# EAGLE design canprotoshield_eth (EAGLE 7.2.0)
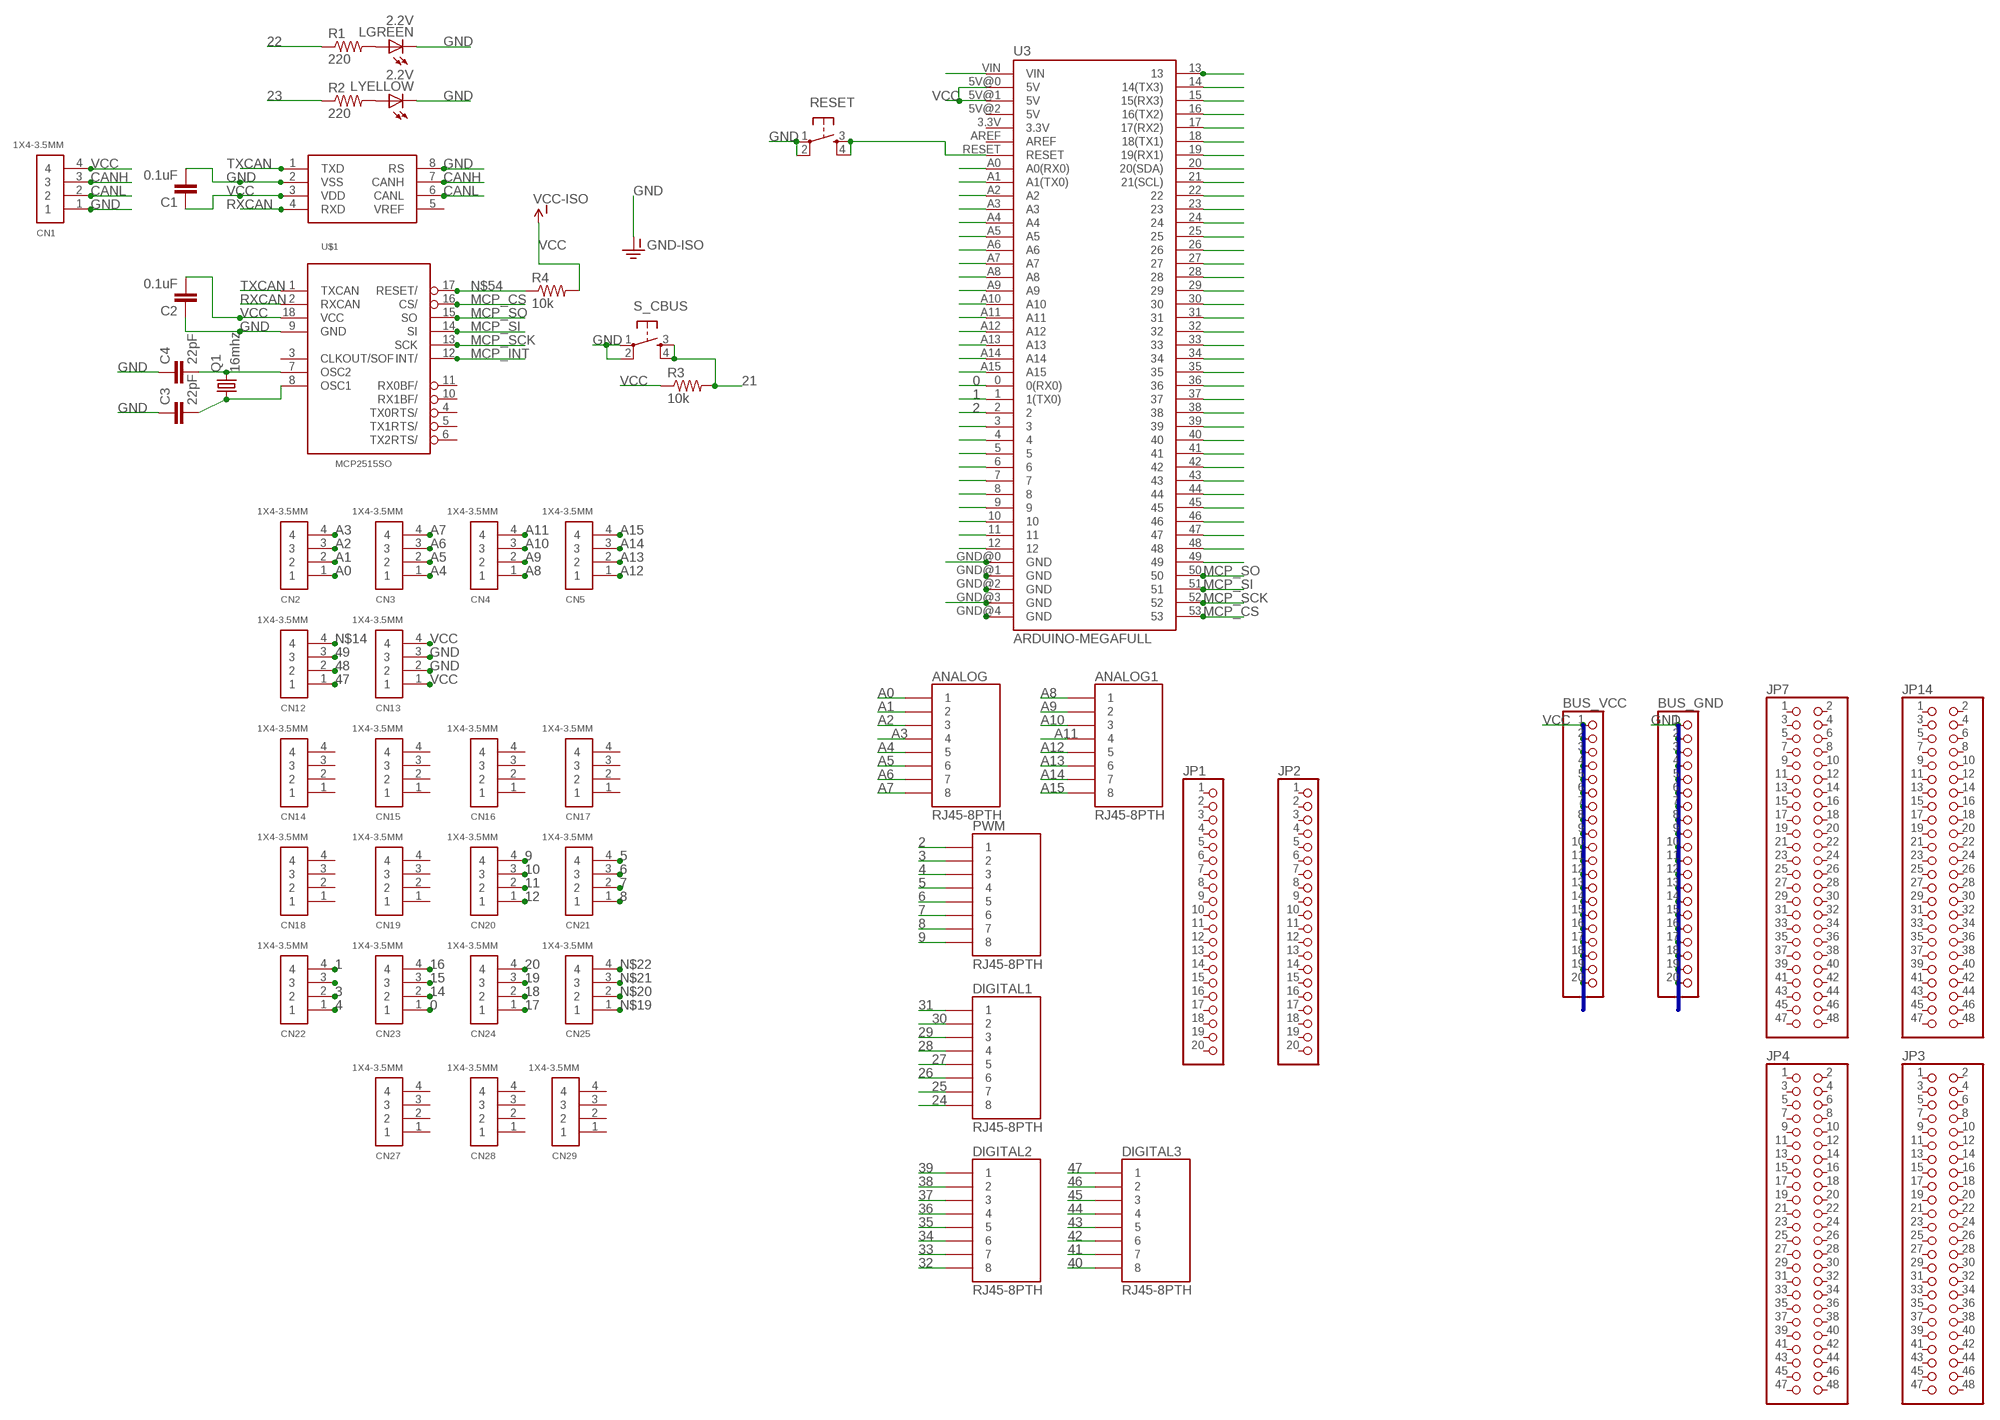
[diagram p0: schematic, sheet 1]

## Parts
ANALOG  RJ45-8PTH  [RJ45-8]
ANALOG1  RJ45-8PTH  [RJ45-8]
BUS_GND  PINHD-1X20  [1X20]
BUS_VCC  PINHD-1X20  [1X20]
C1  0.1uF  CAP0805  [0805]
C2  0.1uF  CAP0805  [0805]
C3  22pF  CAP0805  [0805]
C4  22pF  CAP0805  [0805]
CN1  1X4-3.5MM  [1X04-3.5MM]
CN2  1X4-3.5MM  [1X04-3.5MM]
CN3  1X4-3.5MM  [1X04-3.5MM]
CN4  1X4-3.5MM  [1X04-3.5MM]
CN5  1X4-3.5MM  [1X04-3.5MM]
CN12  1X4-3.5MM  [1X04-3.5MM]
CN13  1X4-3.5MM  [1X04-3.5MM]
CN14  1X4-3.5MM  [1X04-3.5MM]
CN15  1X4-3.5MM  [1X04-3.5MM]
CN16  1X4-3.5MM  [1X04-3.5MM]
CN17  1X4-3.5MM  [1X04-3.5MM]
CN18  1X4-3.5MM  [1X04-3.5MM]
CN19  1X4-3.5MM  [1X04-3.5MM]
CN20  1X4-3.5MM  [1X04-3.5MM]
CN21  1X4-3.5MM  [1X04-3.5MM]
CN22  1X4-3.5MM  [1X04-3.5MM]
CN23  1X4-3.5MM  [1X04-3.5MM]
CN24  1X4-3.5MM  [1X04-3.5MM]
CN25  1X4-3.5MM  [1X04-3.5MM]
CN27  1X4-3.5MM  [1X04-3.5MM]
CN28  1X4-3.5MM  [1X04-3.5MM]
CN29  1X4-3.5MM  [1X04-3.5MM]
DIGITAL1  RJ45-8PTH  [RJ45-8]
DIGITAL2  RJ45-8PTH  [RJ45-8]
DIGITAL3  RJ45-8PTH  [RJ45-8]
JP1  PINHD-1X20-BIG  [1X20-BIG]
JP2  PINHD-1X20-BIG  [1X20-BIG]
JP3  PINHD-2X24  [2X24]
JP4  PINHD-2X24  [2X24]
JP7  PINHD-2X24  [2X24]
JP14  PINHD-2X24  [2X24]
LGREEN  2.2V  LED3MM  [LED3MM]
LYELLOW  2.2V  LED3MM  [LED3MM]
PWM  RJ45-8PTH  [RJ45-8]
Q1  16mhz  CRYSTALHC49S  [HC49/S]
R1  220  R-US_M2012  [M2012]
R2  220  R-US_M2012  [M2012]
R3  10k  R-US_M2012  [M2012]
R4  10k  R-US_M2012  [M2012]
RESET  TAC_SWITCHPTH  [TACTILE-PTH]
S_CBUS  TAC_SWITCHPTH  [TACTILE-PTH]
U2  MCP2551  [SO08]
U3  ARDUINO-MEGAFULL  [ARDUINO_MEGA]
U$1  MCP2515SO  [SO18L]

## Nets
0: CN23.1 U3.0(0(RX0))
1: CN22.4 U3.1(1(TX0))
2: CN22.3 PWM.1 U3.2
3: CN22.2 PWM.2 U3.3
4: CN22.1 PWM.3 U3.4
5: CN21.4 PWM.4 U3.5
6: CN21.3 PWM.5 U3.6
7: CN21.2 PWM.6 U3.7
8: CN21.1 PWM.7 U3.8
9: CN20.4 PWM.8 U3.9
10: CN20.3 U3.10
11: CN20.2 U3.11
12: CN20.1 U3.12
13: U3.13
14: CN23.2 U3.14(14(TX3))
15: CN23.3 U3.15(15(RX3))
16: CN23.4 U3.16(16(TX2))
17: CN24.1 U3.17(17(RX2))
18: CN24.2 U3.18(18(TX1))
19: CN24.3 U3.19(19(RX1))
20: CN24.4 U3.20(20(SDA))
21: R3.2 S_CBUS.3 S_CBUS.4 U3.21(21(SCL))
22: R1.1 U3.22
23: R2.1 U3.23
24: DIGITAL1.8 U3.24
25: DIGITAL1.7 U3.25
26: DIGITAL1.6 U3.26
27: DIGITAL1.5 U3.27
28: DIGITAL1.4 U3.28
29: DIGITAL1.3 U3.29
30: DIGITAL1.2 U3.30
31: DIGITAL1.1 U3.31
32: DIGITAL2.8 U3.32
33: DIGITAL2.7 U3.33
34: DIGITAL2.6 U3.34
35: DIGITAL2.5 U3.35
36: DIGITAL2.4 U3.36
37: DIGITAL2.3 U3.37
38: DIGITAL2.2 U3.38
39: DIGITAL2.1 U3.39
40: DIGITAL3.8 U3.40
41: DIGITAL3.7 U3.41
42: DIGITAL3.6 U3.42
43: DIGITAL3.5 U3.43
44: DIGITAL3.4 U3.44
45: DIGITAL3.3 U3.45
46: DIGITAL3.2 U3.46
47: CN12.1 DIGITAL3.1 U3.47
48: CN12.2 U3.48
49: CN12.3 U3.49
A0: ANALOG.1 CN2.1 U3.A0(A0(RX0))
A1: ANALOG.2 CN2.2 U3.A1(A1(TX0))
A2: ANALOG.3 CN2.3 U3.A2
A3: ANALOG.4 CN2.4 U3.A3
A4: ANALOG.5 CN3.1 U3.A4
A5: ANALOG.6 CN3.2 U3.A5
A6: ANALOG.7 CN3.3 U3.A6
A7: ANALOG.8 CN3.4 U3.A7
A8: ANALOG1.1 CN4.1 U3.A8
A9: ANALOG1.2 CN4.2 U3.A9
A10: ANALOG1.3 CN4.3 U3.A10
A11: ANALOG1.4 CN4.4 U3.A11
A12: ANALOG1.5 CN5.1 U3.A12
A13: ANALOG1.6 CN5.2 U3.A13
A14: ANALOG1.7 CN5.3 U3.A14
A15: ANALOG1.8 CN5.4 U3.A15
CANH: CN1.3 U2.7(CANH)
CANL: CN1.2 U2.6(CANL)
GND: BUS_GND.1 C1.2 C2.1 C3.1 C4.1 CN1.1 CN13.2 CN13.3 LGREEN.K(C) LYELLOW.K(C) RESET.1 RESET.2 S_CBUS.1 S_CBUS.2 U2.8(RS) U3.GND@0(GND) U3.GND@3(GND) U3.GND@4(GND) U$1.9(GND) ; supply symbol labelled GND-ISO
MCP_CS: U3.53 U$1.16(CS/)
MCP_INT: U$1.12(INT/)
MCP_SCK: U3.52 U$1.13(SCK)
MCP_SI: U3.51 U$1.14(SI)
MCP_SO: U3.50 U$1.15(SO)
N$1: C4.2 Q1.2 U$1.7(OSC2)
N$2: C3.2 Q1.1 U$1.8(OSC1)
N$3: LYELLOW.A R2.2
N$4: LGREEN.A R1.2
N$5: BUS_VCC.1
N$6: BUS_VCC.2
N$7: BUS_VCC.3
N$8: BUS_VCC.4
N$9: RESET.3 RESET.4 U3.RESET
N$10: BUS_VCC.5
N$11: BUS_VCC.6
N$12: BUS_VCC.7
N$13: BUS_VCC.8
N$14: CN12.4
N$15: BUS_VCC.9
N$16: BUS_VCC.10
N$17: BUS_VCC.11
N$18: BUS_VCC.12
N$19: CN25.1
N$20: CN25.2
N$21: CN25.3
N$22: CN25.4
N$23: BUS_VCC.13
N$24: BUS_VCC.14
N$25: BUS_VCC.15
N$26: BUS_VCC.16
N$27: BUS_VCC.17
N$28: BUS_VCC.18
N$29: BUS_VCC.19
N$30: BUS_VCC.20
N$32: BUS_GND.2
N$33: BUS_GND.3
N$34: BUS_GND.4
N$35: BUS_GND.5
N$36: BUS_GND.6
N$37: BUS_GND.7
N$38: BUS_GND.8
N$39: BUS_GND.9
N$40: BUS_GND.10
N$41: BUS_GND.11
N$42: BUS_GND.12
N$43: BUS_GND.13
N$44: BUS_GND.14
N$45: BUS_GND.15
N$46: BUS_GND.16
N$47: BUS_GND.17
N$48: BUS_GND.18
N$49: BUS_GND.19
N$50: BUS_GND.20
N$54: R4.1 U$1.17(RESET/)
N$55: U3.GND@1(GND)
N$56: U3.GND@2(GND)
RXCAN: U2.4(RXD) U$1.2(RXCAN)
TXCAN: U2.1(TXD) U$1.1(TXCAN)
VCC: C1.1 C2.2 CN1.4 CN13.1 CN13.4 R3.1 R4.2 U3.5V@0(5V) U3.5V@1(5V) U$1.18(VCC) ; supply symbol labelled VCC-ISO
VIN: U3.VIN
Unconnected: CN14.1 CN14.2 CN14.3 CN14.4 CN15.1 CN15.2 CN15.3 CN15.4 CN16.1 CN16.2 CN16.3 CN16.4 CN17.1 CN17.2 CN17.3 CN17.4 CN18.1 CN18.2 CN18.3 CN18.4 CN19.1 CN19.2 CN19.3 CN19.4 CN27.1 CN27.2 CN27.3 CN27.4 CN28.1 CN28.2 CN28.3 CN28.4 CN29.1 CN29.2 CN29.3 CN29.4 JP1.1 JP1.2 JP1.3 JP1.4 JP1.5 JP1.6 JP1.7 JP1.8 JP1.9 JP1.10 JP1.11 JP1.12 JP1.13 JP1.14 JP1.15 JP1.16 JP1.17 JP1.18 JP1.19 JP1.20 JP2.1 JP2.2 JP2.3 JP2.4 JP2.5 JP2.6 JP2.7 JP2.8 JP2.9 JP2.10 JP2.11 JP2.12 JP2.13 JP2.14 JP2.15 JP2.16 JP2.17 JP2.18 JP2.19 JP2.20 JP3.1 JP3.2 JP3.3 JP3.4 JP3.5 JP3.6 JP3.7 JP3.8 JP3.9 JP3.10 JP3.11 JP3.12 JP3.13 JP3.14 JP3.15 JP3.16 JP3.17 JP3.18 JP3.19 JP3.20 JP3.21 JP3.22 JP3.23 JP3.24 JP3.25 JP3.26 JP3.27 JP3.28 JP3.29 JP3.30 JP3.31 JP3.32 JP3.33 JP3.34 JP3.35 JP3.36 JP3.37 JP3.38 JP3.39 JP3.40 JP3.41 JP3.42 JP3.43 JP3.44 JP3.45 JP3.46 JP3.47 JP3.48 JP4.1 JP4.2 JP4.3 JP4.4 JP4.5 JP4.6 JP4.7 JP4.8 JP4.9 JP4.10 JP4.11 JP4.12 JP4.13 JP4.14 JP4.15 JP4.16 JP4.17 JP4.18 JP4.19 JP4.20 JP4.21 JP4.22 JP4.23 JP4.24 JP4.25 JP4.26 JP4.27 JP4.28 JP4.29 JP4.30 JP4.31 JP4.32 JP4.33 JP4.34 JP4.35 JP4.36 JP4.37 JP4.38 JP4.39 JP4.40 JP4.41 JP4.42 JP4.43 JP4.44 JP4.45 JP4.46 JP4.47 JP4.48 JP7.1 JP7.2 JP7.3 JP7.4 JP7.5 JP7.6 JP7.7 JP7.8 JP7.9 JP7.10 JP7.11 JP7.12 JP7.13 JP7.14 JP7.15 JP7.16 JP7.17 JP7.18 JP7.19 JP7.20 JP7.21 JP7.22 JP7.23 JP7.24 JP7.25 JP7.26 JP7.27 JP7.28 JP7.29 JP7.30 JP7.31 JP7.32 JP7.33 JP7.34 JP7.35 JP7.36 JP7.37 JP7.38 JP7.39 JP7.40 JP7.41 JP7.42 JP7.43 JP7.44 JP7.45 JP7.46 JP7.47 JP7.48 JP14.1 JP14.2 JP14.3 JP14.4 JP14.5 JP14.6 JP14.7 JP14.8 JP14.9 JP14.10 JP14.11 JP14.12 JP14.13 JP14.14 JP14.15 JP14.16 JP14.17 JP14.18 JP14.19 JP14.20 JP14.21 JP14.22 JP14.23 JP14.24 JP14.25 JP14.26 JP14.27 JP14.28 JP14.29 JP14.30 JP14.31 JP14.32 JP14.33 JP14.34 JP14.35 JP14.36 JP14.37 JP14.38 JP14.39 JP14.40 JP14.41 JP14.42 JP14.43 JP14.44 JP14.45 JP14.46 JP14.47 JP14.48 U2.2(VSS) U2.3(VDD) U2.5(VREF) U3.3.3V U3.5V@2(5V) U3.AREF U$1.3(CLKOUT/SOF) U$1.4(TX0RTS/) U$1.5(TX1RTS/) U$1.6(TX2RTS/) U$1.10(RX1BF/) U$1.11(RX0BF/)

## Buses
GND
VCC

## Library data of the parts
ANALOG ANALOG1 DIGITAL1-DIGITAL3 PWM = SparkFun-Connectors:RJ45-8: RJ45 Jack Simple RJ45, 8-pin connection - connector for common Cat5, Cat5e, and Cat6 Ethernet cables. Footprint not yet proven in production. Connector sku is PRT-00643; Breakout PCB sku is BOB-00716.
BUS_GND BUS_VCC JP1 JP2 = adafruit:PINHD-1X20: PIN HEADER
C1-C4 = SparkFun-Capacitors:CAP: Capacitor Standard 0603 ceramic capacitor, and 0.1" leaded capacitor.
CN1-CN5 CN12-CN25 CN27-CN29 = Arduino_merg:1X4: 4-pin connector
JP3 JP4 JP7 JP14 = pinhead:PINHD-2X24: PIN HEADER
LGREEN LYELLOW = adafruit:LED: LED OSRAM: - CHIPLED LG R971, LG N971, LY N971, LG Q971, LY Q971, LO R971, LY R971 LH N974, LH R974 LS Q976, LO Q976, LY Q976 LO Q996 - Hyper CHIPLED LW Q18S LB Q993, LB Q99A, LB R99A - SideLED LS A670, LO A670, LY A670, LG A670, LP A670 LB A673, LV A673, LT A673, LW A673 LH A674 LY A675 LS A676, LA A676, LO A676, LY A676, LW A676 LS A679, LY A679, LG A679 - Hyper Micro SIDELED® LS Y876, LA Y876, LO Y876, LY Y876 LT Y87S - SmartLED LW L88C, LW L88S LB L89C, LB L89S, LG L890 LS L89K, LO L89K, LY L89K LS L896, LA L896, LO L896, LY L896 - TOPLED LS T670, LO T670, LY T670, LG T670, LP T670 LSG T670, LSP T670, LSY T670, LOP T670, LYG T670 LG T671, LOG T671, LSG T671 LB T673, LV T673, LT T673, LW T673 LH T674 LS T676, LA T676, LO T676, LY T676, LB T676, LH T676, LSB T676, LW T676 LB T67C, LV T67C, LT T67C, LS T67K, LO T67K, LY T67K, LW E67C LS E67B, LA E67B, LO E67B, LY E67B, LB E67C, LV E67C, LT E67C LW T67C LS T679, LY T679, LG T679 LS T770, LO T770, LY T770, LG T770, LP T770 LB T773, LV T773, LT T773, LW T773 LH T774 LS E675, LA E675, LY E675, LS T675 LS T776, LA T776, LO T776, LY T776, LB T776 LHGB T686 LT T68C, LB T68C - Hyper Mini TOPLED® LB M676 - Mini TOPLED Santana® LG M470 LS M47K, LO M47K, LY M47K Source: http://www.osram.convergy.de/
Q1 = adafruit:CRYSTAL: CRYSTAL; OC_FARNELL: 1667008; OC_NEWARK: unknown
R1-R4 = adafruit:R-US_: RESISTOR, American symbol
RESET S_CBUS = SparkFun-Retired:TAC_SWITCH: Momentary Switch Button commonly used for reset or general input. Spark Fun Electronics SKU : COM-00097 SMT- SWCH-08247
U2 = SparkFun-DigitalIC:MCP2551: CAN transceiver; PROD_ID: IC-09907
U3 = Arduino_merg:ARDUINO-MEGA: Arduino Mega board footprint
U$1 = MCP2515_MT:MCP2515*: MCP2515 Standalone CAN-Controller by Microchip Eagle-Lib. by MartinThomas

## Board
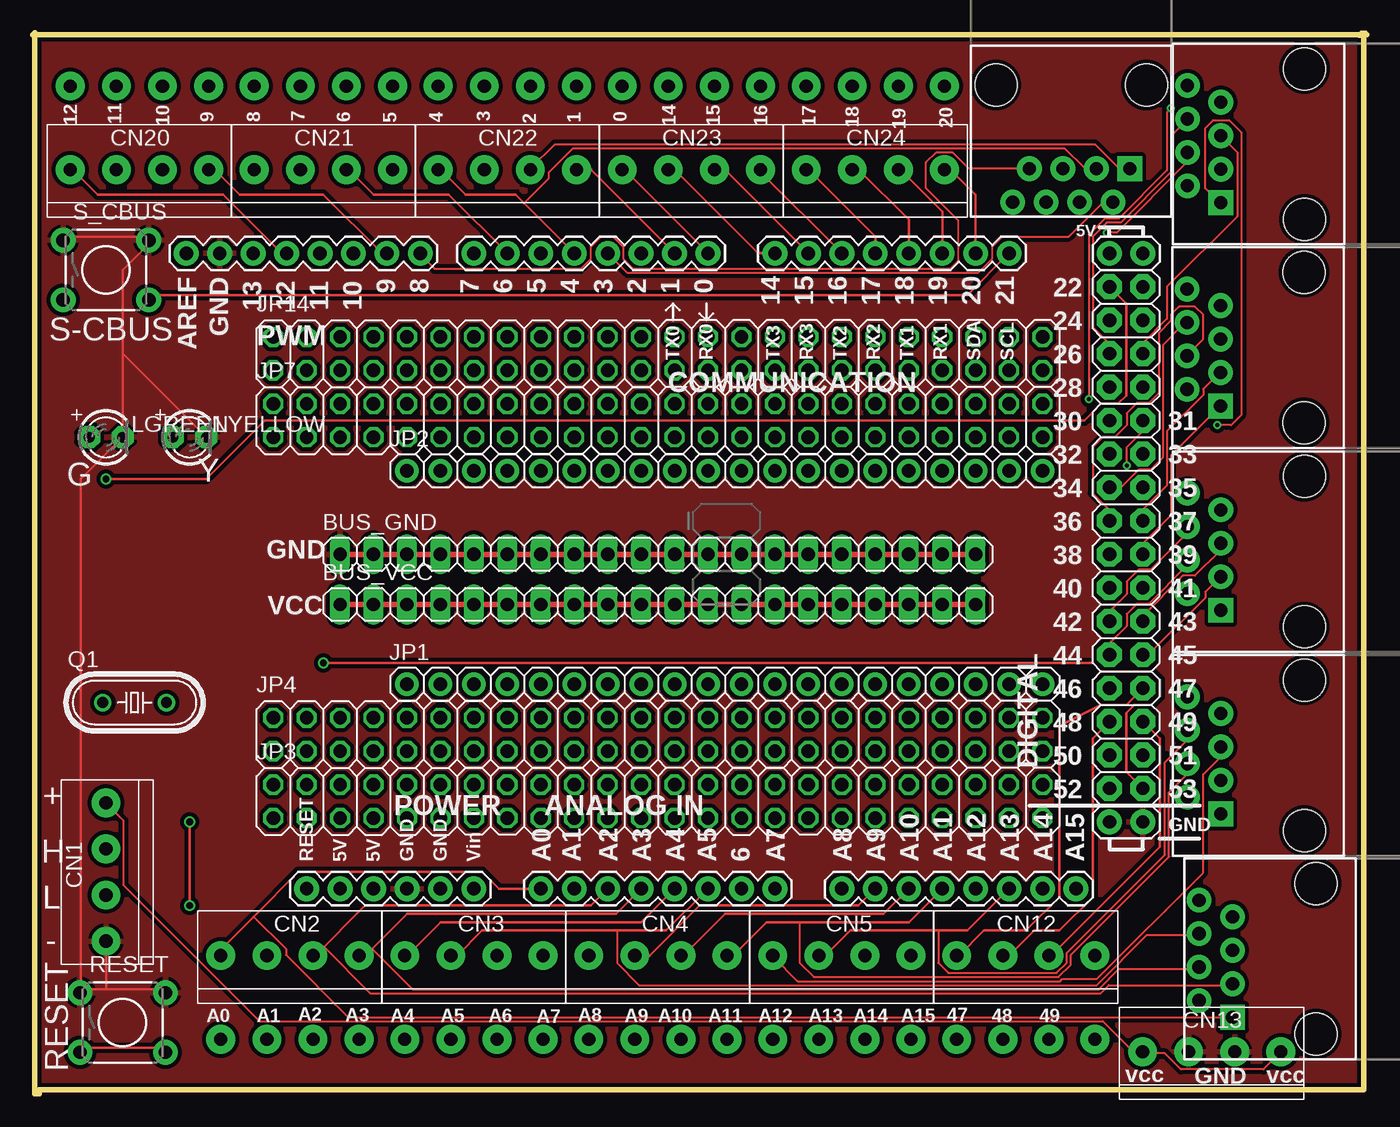
[diagram p1: board, top side]
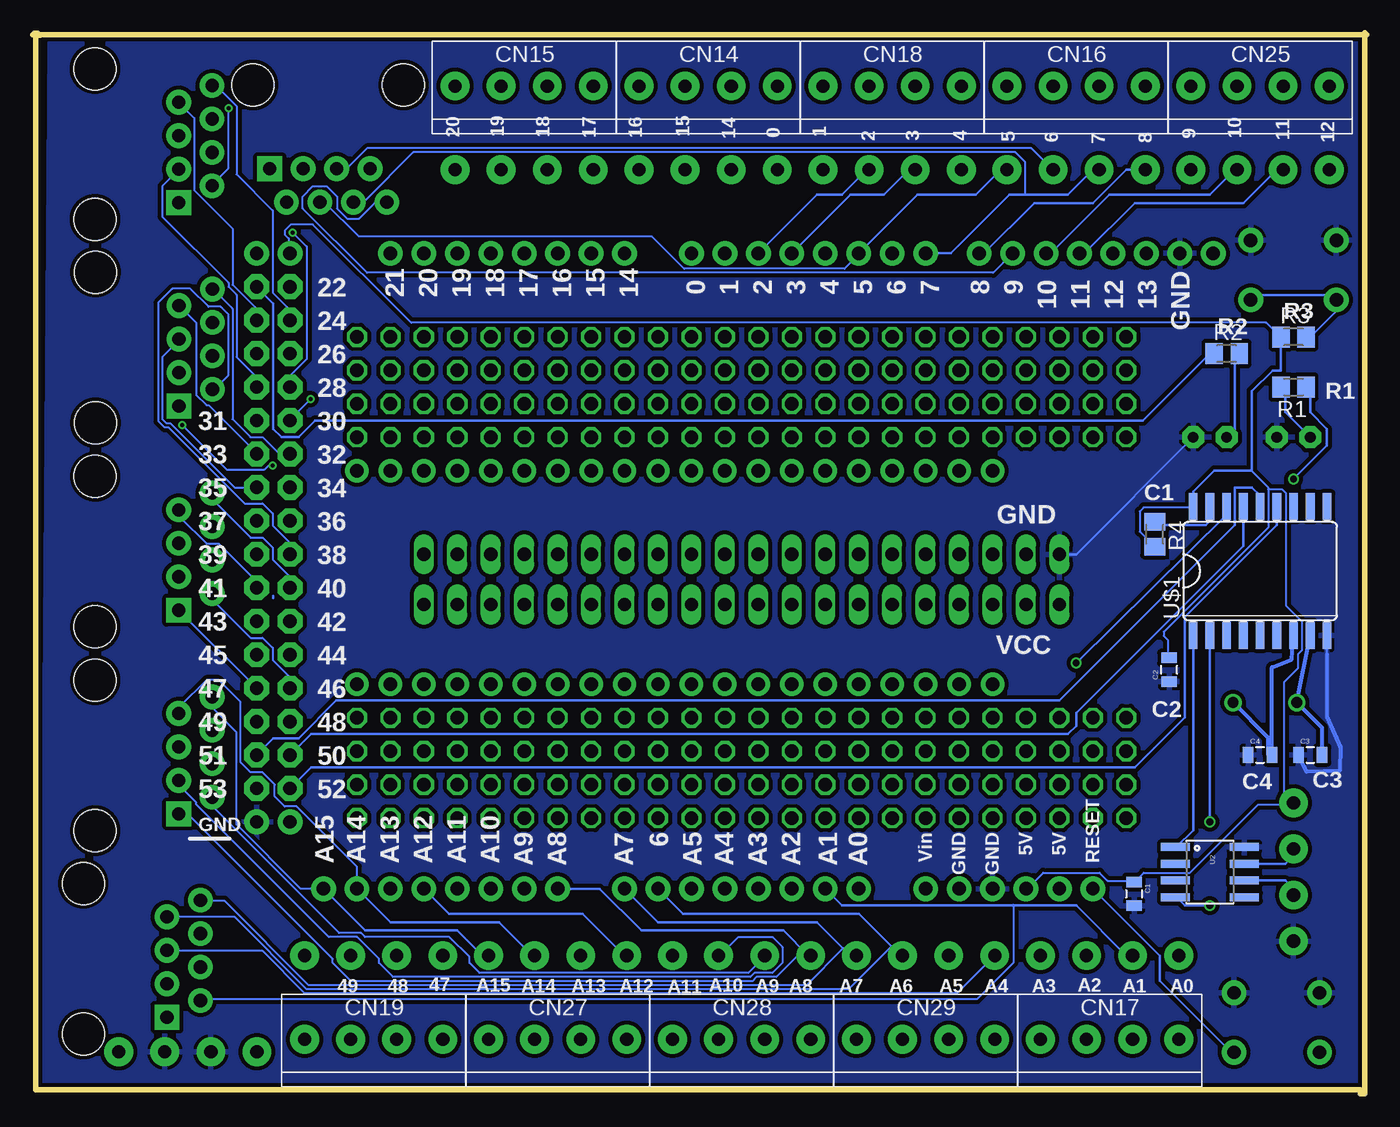
[diagram p2: board, bottom side, seen from below]

Size 101.27 x 80.57 mm. Coordinates in mm from the lower left corner, seen from the top.
Outline: 0.47,0.34 100.47,0.34
Outline: 100.47,80.34 0.47,80.34
Outline: 100.72,80.4 101.05,80.4 101.05,0.31 0.47,0.31 0.47,0 0.13,0 0.13,80.57
Outline: 0,80.43 101.16,80.43
Outline: 101.27,80.43 101.16,80.43
Outline: 101.16,80.43 101.16,80.55 100.92,80.55
Copper layers (1*16): Top 0.035mm / dielectric 1.5mm / Bottom 0.035mm
Design rules "Elecrow_2-layer_eagle_rule": minimum track width 6mil, minimum drill 12mil, track to track 6mil, track to pad 6mil, pad to pad 6mil, via to via 6mil, smd to smd 0mil, copper to edge 10mil, drill to drill 10mil, minimum pad ring 10mil, minimum via ring 6mil, stop-mask expansion 2mil, vias tented up to drill 100mil, thermal gap 10mil

### Footprints (pad centres in the part's own frame; a part is rotated, then mirrored left to right if it is on the bottom)
RJ45-8 = drill 1 pad 1.88 square: 1 -4.445,6.35 | drill 1 pad 1.88: 2 -3.175,8.89; 3 -1.905,6.35; 4 -0.635,8.89; 5 0.635,6.35; 6 1.905,8.89; 7 3.175,6.35; 8 4.445,8.89 | hole 3.2: -5.715,0; 5.715,0
1X20 = drill 1.016 long: 1 -24.13,0; 2 -21.59,0; 3 -19.05,0; 4 -16.51,0; 5 -13.97,0; 6 -11.43,0; 7 -8.89,0; 8 -6.35,0; 9 -3.81,0; 10 -1.27,0; 11 1.27,0; 12 3.81,0; 13 6.35,0; 14 8.89,0; 15 11.43,0; 16 13.97,0; 17 16.51,0; 18 19.05,0; 19 21.59,0; 20 24.13,0
0805 = smd 0.8 x 1.2: 1 -0.9,0; 2 0.9,0
1X04-3.5MM = drill 1 pad 2.184: 1 -5.25,0; 2 -1.75,0; 3 1.75,0; 4 5.25,0
1X20-BIG = drill 1.016 pad 1.778: 1 -24.13,0; 2 -21.59,0; 3 -19.05,0; 4 -16.51,0; 5 -13.97,0; 6 -11.43,0; 7 -8.89,0; 8 -6.35,0; 9 -3.81,0; 10 -1.27,0; 11 1.27,0; 12 3.81,0; 13 6.35,0; 14 8.89,0; 15 11.43,0; 16 13.97,0; 17 16.51,0; 18 19.05,0; 19 21.59,0; 20 24.13,0
2X24 = drill 1.016 octagon: 1 -27.94,-1.27; 2 -27.94,1.27; 3 -25.4,-1.27; 4 -25.4,1.27; 5 -22.86,-1.27; 6 -22.86,1.27; 7 -20.32,-1.27; 8 -20.32,1.27; 9 -17.78,-1.27; 10 -17.78,1.27; 11 -15.24,-1.27; 12 -15.24,1.27; 13 -12.7,-1.27; 14 -12.7,1.27; 15 -10.16,-1.27; 16 -10.16,1.27; 17 -7.62,-1.27; 18 -7.62,1.27; 19 -5.08,-1.27; 20 -5.08,1.27; 21 -2.54,-1.27; 22 -2.54,1.27; 23 0,-1.27; 24 0,1.27; 25 2.54,-1.27; 26 2.54,1.27; 27 5.08,-1.27; 28 5.08,1.27; 29 7.62,-1.27; 30 7.62,1.27; 31 10.16,-1.27; 32 10.16,1.27; 33 12.7,-1.27; 34 12.7,1.27; 35 15.24,-1.27; 36 15.24,1.27; 37 17.78,-1.27; 38 17.78,1.27; 39 20.32,-1.27; 40 20.32,1.27; 41 22.86,-1.27; 42 22.86,1.27; 43 25.4,-1.27; 44 25.4,1.27; 45 27.94,-1.27; 46 27.94,1.27; 47 30.48,-1.27; 48 30.48,1.27
LED3MM = drill 0.813 pad 1.676 octagon: A -1.27,0; K 1.27,0
HC49/S = drill 0.813: 1 -2.413,0; 2 2.413,0
M2012 = smd 1.3 x 1.6: 1 -0.95,0; 2 0.95,0
TACTILE-PTH = drill 1.016 pad 1.88: 1 -3.251,2.261; 2 3.251,2.261; 3 -3.251,-2.261; 4 3.251,-2.261
SO08 = smd 0.61 x 2.21: 1 -1.905,-2.616; 2 -0.635,-2.616; 3 0.635,-2.616; 4 1.905,-2.616; 5 1.905,2.616; 6 0.635,2.616; 7 -0.635,2.616; 8 -1.905,2.616
ARDUINO_MEGA = drill 1.016 pad 1.88: 0 63.5,50.8; 1 60.96,50.8; 2 58.42,50.8; 3 55.88,50.8; 3.3V 35.56,2.54; 4 53.34,50.8; 5 50.8,50.8; 5V@0 38.1,2.54; 5V@1 93.98,50.8; 5V@2 96.52,50.8; 6 48.26,50.8; 7 45.72,50.8; 8 41.656,50.8; 9 39.116,50.8; 10 36.576,50.8; 11 34.036,50.8; 12 31.496,50.8; 13 28.956,50.8; 14 68.58,50.8; 15 71.12,50.8; 16 73.66,50.8; 17 76.2,50.8; 18 78.74,50.8; 19 81.28,50.8; 20 83.82,50.8; 21 86.36,50.8; A0 50.8,2.54; A1 53.34,2.54; A2 55.88,2.54; A3 58.42,2.54; A4 60.96,2.54; A5 63.5,2.54; A6 66.04,2.54; A7 68.58,2.54; A8 73.66,2.54; A9 76.2,2.54; A10 78.74,2.54; A11 81.28,2.54; A12 83.82,2.54; A13 86.36,2.54; A14 88.9,2.54; A15 91.44,2.54; AREF 23.876,50.8; GND@0 40.64,2.54; GND@1 43.18,2.54; GND@2 93.98,7.62; GND@3 96.52,7.62; GND@4 26.416,50.8; RESET 33.02,2.54; VIN 45.72,2.54 | drill 1.016 pad 1.88 octagon: 22 93.98,48.26; 23 96.52,48.26; 24 93.98,45.72; 25 96.52,45.72; 26 93.98,43.18; 27 96.52,43.18; 28 93.98,40.64; 29 96.52,40.64; 30 93.98,38.1; 31 96.52,38.1; 32 93.98,35.56; 33 96.52,35.56; 34 93.98,33.02; 35 96.52,33.02; 36 93.98,30.48; 37 96.52,30.48; 38 93.98,27.94; 39 96.52,27.94; 40 93.98,25.4; 41 96.52,25.4; 42 93.98,22.86; 43 96.52,22.86; 44 93.98,20.32; 45 96.52,20.32; 46 93.98,17.78; 47 96.52,17.78; 48 93.98,15.24; 49 96.52,15.24; 50 93.98,12.7; 51 96.52,12.7; 52 93.98,10.16; 53 96.52,10.16
SO18L = smd 0.66 x 2.032: 1 -5.08,-4.902; 2 -3.81,-4.902; 3 -2.54,-4.902; 4 -1.27,-4.902; 5 0,-4.902; 6 1.27,-4.902; 7 2.54,-4.902; 8 3.81,-4.902; 9 5.08,-4.902; 10 5.08,4.902; 11 3.81,4.902; 12 2.54,4.902; 13 1.27,4.902; 14 0,4.902; 15 -1.27,4.902; 16 -2.54,4.902; 17 -3.81,4.902; 18 -5.08,4.902

### Placement (x,y rotation side)
ANALOG  97.45,10.26 90 top
ANALOG1  96.55,25.71 90 top
BUS_GND  47.46,40.98 0 top
BUS_VCC  47.46,37.17 0 top
C1  17.65,15.19 270 bottom
C2  14.99,32.21 90 bottom
C3  4.28,25.74 0 bottom
C4  8.09,25.74 0 bottom
CN1  5.55,16.85 90 top
CN2  19.52,10.5 0 top
CN3  33.49,10.5 0 top
CN4  47.46,10.5 0 top
CN5  61.43,10.5 0 top
CN12  75.4,10.5 0 top
CN13  89.51,3.19 0 top
CN14  50,76.54 0 bottom
CN15  63.97,76.54 0 bottom
CN16  22.06,76.54 0 bottom
CN17  19.52,4.15 0 bottom
CN18  36.03,76.54 0 bottom
CN19  75.4,4.15 0 bottom
CN20  8.09,70.19 0 top
CN21  22.06,70.19 0 top
CN22  36.03,70.19 0 top
CN23  50,70.19 0 top
CN24  63.97,70.19 0 top
CN25  8.09,76.54 0 bottom
CN27  61.43,4.15 0 bottom
CN28  47.46,4.15 0 bottom
CN29  33.49,4.15 0 bottom
DIGITAL1  96.56,72.14 90 top
DIGITAL2  96.53,56.68 90 top
DIGITAL3  96.55,41.18 90 top
JP1  52.54,31.1 0 top
JP2  52.54,47.33 0 top
JP3  46.19,22.21 0 top
JP4  46.19,27.29 0 top
JP7  46.19,51.14 0 top
JP14  46.19,56.22 0 top
LGREEN  5.55,49.87 0 top
LYELLOW  11.9,49.87 0 top
PWM  78.84,76.62 180 top
Q1  7.72,29.72 0 top
R1  5.55,53.68 180 bottom
R2  10.63,56.22 0 bottom
R3  5.55,57.49 0 bottom
R4  16.09,42.5 270 bottom
RESET  6.82,5.42 0 top
S_CBUS  5.55,62.57 0 top
U2  11.9,16.85 270 bottom
U3  -12.23,13.04 0 top
U$1  8.09,39.71 0 bottom

### Tracks (layer width: path | path; a pad name or v marks a point on that pad's centre or on a via)
0
  Top 0.203: U3.0 44.92,70.19 CN23.1
1
  Top 0.203: U3.1 42.38,70.19 CN22.4
2
  Top 0.152: PWM.1 83.22,70.29 82.46,70.29 80.63,72.12 39.63,72.12 37.8,70.29 CN22.3
  Bottom 0.203: U3.2 41.74,68.28 39.84,68.28 37.93,70.19 CN22.3
3
  Top 0.152: U3.3 45.12,62.36 71.79,62.36 72.86,63.43 72.86,64.34 73.62,65.11 78.65,65.11 81.24,67.7 82,67.7 PWM.2
  Bottom 0.203: U3.3 39.2,68.28 36.66,68.28 34.76,70.19 CN22.2
4
  Top 0.152: 37.3,67.65 39.18,69.53 39.18,69.98 41,71.81 78.34,71.81 79.87,70.29 80.63,70.29 PWM.3
  Top 0.203: U3.4 37.3,67.65 36.66,68.28 32.85,68.28 30.95,70.19 CN22.1
5
  Bottom 0.152: PWM.4 79.41,67.7 79.1,67.7 76.51,65.11 54.26,65.11 51.83,62.67 39.63,62.67 38.57,63.73 U3.5
  Bottom 0.203: U3.5 34.12,68.28 29.68,68.28 27.77,70.19 CN21.4
6
  Top 0.203: U3.6 31.58,68.28 25.87,68.28 23.96,70.19 CN21.3
  Bottom 0.152: PWM.5 78.19,70.29 77.43,70.29 75.9,71.81 25.46,71.81 23.94,70.29 CN21.3
7
  Bottom 0.152: 25.92,68.28 25.92,70.75 26.68,71.51 72.4,71.51 76.06,67.85 76.82,67.85 PWM.6
  Bottom 0.203: U3.7 31.58,63.84 27.14,68.28 25.92,68.28 22.69,68.28 20.79,70.19 CN21.2
8
  Top 0.152: PWM.7 75.6,70.29 71.03,70.29 69.81,71.51 68.59,71.51 67.83,70.75 67.83,68.76 70.27,66.33 70.27,63.28 69.66,62.67 45.58,62.67 44.81,63.43 44.81,64.34 44.05,65.11 43.14,65.11 42.38,64.34 42.38,63.43 41.61,62.67 30.49,62.67 29.42,63.73 U3.8
  Bottom 0.203: CN21.1 18.25,70.19 20.79,67.65 25.23,67.65 29.04,63.84 U3.8
9
  Top 0.203: U3.9 26.5,63.84 22.06,68.28 15.71,68.28 13.8,70.19 CN20.4
  Bottom 0.152: U3.9 28.36,62.36 75.9,62.36 80.78,67.24 80.78,68.15 80.02,68.92 78.95,68.92 78.19,68.15 78.19,67.24 77.43,66.48 76.51,66.48 75.29,67.7 74.53,67.7 PWM.8
10
  Bottom 0.203: U3.10 23.96,63.84 19.52,68.28 11.9,68.28 9.99,70.19 CN20.3
11
  Bottom 0.203: U3.11 21.42,63.84 17.61,67.65 9.36,67.65 6.82,70.19 CN20.2
12
  Top 0.203: U3.12 18.88,63.84 14.44,68.28 4.91,68.28 3.01,70.19 CN20.1
14
  Top 0.203: U3.14 55.08,63.84 48.73,70.19 CN23.2
15
  Top 0.203: U3.15 52.54,70.19 CN23.3
16
  Top 0.203: U3.16 55.08,70.19 CN23.4
17
  Top 0.203: U3.17 63.97,65.11 58.89,70.19 CN24.1
18
  Top 0.203: U3.18 66.51,66.38 62.7,70.19 CN24.2
19
  Top 0.203: U3.19 69.05,67.01 65.87,70.19 CN24.3
20
  Top 0.203: U3.20 71.59,68.28 69.68,70.19 CN24.4
21
  Top 0.203: U3.21 70.95,60.66 9.36,60.66 S_CBUS.4
  Bottom 0.203: R3.2 4.28,57.49 1.74,60.03 S_CBUS.3 2.37,60.66 8.72,60.66 S_CBUS.4
22  (via drill 0.51)
  Top 0.203: U3.22 83.02,60.03 83.02,53.04 82.38,52.41 81.11,52.41 79.84,51.14 17.61,51.14 13.17,46.69 v5.55,46.69
  Bottom 0.203: v5.55,46.69 3.01,49.23 3.01,50.5 4.28,51.77 4.28,53.68 R1.1
23
  Bottom 0.203: U3.23 83.02,60.03 83.02,50.5 82.38,49.87 81.11,49.87 79.84,51.14 16.98,51.14 11.9,56.22 R2.1
24
  Bottom 0.152: U3.24 81.85,58.86 81.85,59.62 83.07,60.84 83.07,67.09 85.81,69.83 85.81,75.01 87.33,76.54 87.64,76.54 DIGITAL1.8
25
  Bottom 0.152: U3.25 84.29,59.62 86.12,61.45 86.12,65.72 89.01,68.61 89.01,74.1 90.08,75.16 DIGITAL1.7
26
  Top 0.152: U3.26 81.7,56.27 81.7,57.03 80.48,58.25 80.48,65.11 81.54,66.17 82.61,66.17 86.42,69.98 86.42,72.73 87.64,73.95 DIGITAL1.6
27
  Top 0.152: U3.27 84.29,57.03 86.12,58.86 86.12,61.3 91.45,66.63 91.45,71.51 90.23,72.73 DIGITAL1.5
28  (via drill 0.3)
  Top 0.152: v81.54,65.41 82.31,65.41 87.64,70.75 87.64,71.35 DIGITAL1.4
  Bottom 0.152: v81.54,65.41 80.48,64.34 80.48,55.81 81.7,54.59 81.7,53.68 U3.28
29
  Bottom 0.152: U3.29 84.29,54.44 85.81,55.96 85.81,60.69 86.42,61.3 86.42,61.6 91.45,66.63 91.45,68.92 90.23,70.14 DIGITAL1.3
30  (via drill 0.3)
  Top 0.152: v80.17,52.76 80.17,65.26 81.39,66.48 82.46,66.48 86.12,70.14 86.12,74.56 v86.42,74.86
  Bottom 0.152: v80.17,52.76 81.7,51.24 U3.30 | v86.42,74.86 86.42,70.29 87.64,69.07 DIGITAL1.2
31  (via drill 0.3)
  Top 0.152: U3.31 84.29,50.32 83.07,49.1 v83.07,47.73 | v89.93,50.78 90.99,50.78 91.75,51.54 91.75,73.03 90.84,73.95 89.62,73.95 89.01,73.34 89.01,68.76 90.08,67.7 DIGITAL1.1
  Bottom 0.152: v83.07,47.73 83.37,47.73 83.68,47.43 86.57,47.43 v89.93,50.78
32
  Bottom 0.152: U3.32 81.85,48.65 82.61,48.65 83.83,49.87 84.74,49.87 86.12,51.24 86.12,59.62 87.49,60.99 DIGITAL2.8
33
  Bottom 0.152: U3.33 84.29,48.65 87.94,52.3 88.1,52.3 88.86,53.07 88.86,58.55 90.08,59.77 DIGITAL2.7
34
  Top 0.152: U3.34 82.61,46.06 83.98,47.43 84.9,47.43 85.81,48.34 85.81,56.88 87.49,58.55 DIGITAL2.6
35
  Bottom 0.152: U3.35 85.96,46.06 90.84,50.93 91.14,50.93 91.45,51.24 91.45,55.96 90.23,57.18 DIGITAL2.5
36
  Top 0.152: U3.36 81.7,43.62 81.7,44.38 80.48,45.6 80.48,49.1 81.24,49.87 82.15,49.87 83.07,50.78 83.07,51.7 83.83,52.46 84.74,52.46 85.51,53.22 85.51,57.79 86.42,58.71 86.42,59.16 87.03,59.77 88.25,59.77 88.86,59.16 88.86,57.33 87.64,56.11 DIGITAL2.4
37
  Top 0.152: U3.37 84.29,44.38 86.12,46.21 86.12,50.32 88.86,53.07 88.86,53.52 90.08,54.74 DIGITAL2.3
38
  Bottom 0.152: U3.38 81.85,41.03 81.85,41.94 83.07,43.16 83.07,44.08 83.83,44.84 85.2,44.84 90.99,50.63 91.3,50.63 91.75,51.09 91.75,60.08 90.69,61.14 89.32,61.14 87.94,59.77 87.03,59.77 86.42,59.16 86.42,54.59 87.49,53.52 DIGITAL2.2
39
  Top 0.152: U3.39 84.29,41.79 86.42,43.92 86.42,48.49 90.08,52.15 DIGITAL2.1
40
  Bottom 0.152: U3.40 81.85,38.44 81.85,39.35 83.07,40.57 83.07,41.48 83.83,42.25 84.74,42.25 87.64,45.14 87.64,45.6 DIGITAL3.8
41
  Bottom 0.152: U3.41 84.29,38.89 87.18,41.79 88.1,41.79 90.08,43.77 90.08,44.23 DIGITAL3.7
42
  Top 0.152: U3.42 81.85,36 81.85,36.76 83.07,37.98 83.07,38.89 83.98,39.81 84.9,39.81 87.64,42.55 87.64,43.01 DIGITAL3.6
43
  Top 0.152: U3.43 84.29,36.3 87.33,39.35 88.25,39.35 90.08,41.18 90.08,41.79 DIGITAL3.5
44
  Top 0.152: U3.44 81.85,33.41 81.85,34.32 83.07,35.54 83.07,36.46 83.83,37.22 84.74,37.22 87.64,40.11 87.64,40.42 DIGITAL3.4
45
  Top 0.152: U3.45 84.29,33.41 84.74,33.41 89.01,37.67 89.01,38.13 90.08,39.2 DIGITAL3.3
46
  Bottom 0.152: U3.46 81.85,30.82 81.85,31.73 83.07,32.95 83.07,33.86 83.83,34.63 84.74,34.63 87.64,37.52 87.64,37.98 DIGITAL3.2
47
  Top 0.203: U3.47 83.02,29.55 81.11,29.55 77.94,27.93 77.94,14.94 75.4,12.4 72.22,12.4 70.32,10.5 CN12.1
  Bottom 0.152: U3.47 90.08,36.61 DIGITAL3.1
48
  Top 0.203: U3.48 80.48,27.01 80.48,14.94 77.94,12.4 76.03,12.4 74.13,10.5 CN12.2
49
  Top 0.203: U3.49 85.56,27.01 85.56,18.75 77.3,10.5 CN12.3
A0
  Top 0.152: 16.76,13.46 19.21,11 19.21,10.55 23.94,5.82 90.99,5.82 ANALOG.1
  Top 0.203: U3.A0 35.39,15.58 34.12,16.85 20.15,16.85 16.76,13.46 13.8,10.5 CN2.1
A1
  Bottom 0.152: ANALOG.2 88.55,7.19 29.57,7.19 26.83,9.94 26.83,14.31 26.83,14.36
  Bottom 0.203: U3.A1 39.84,14.31 26.83,14.31 22.06,14.31 18.25,10.5 CN2.2
A2
  Top 0.152: ANALOG.3 90.99,8.26 81.7,8.26 81.09,7.65 25.61,7.65 22.11,11.16 CN2.3
  Top 0.203: U3.A2 42.38,14.31 25.23,14.31 21.42,10.5 CN2.3
A3
  Top 0.152: ANALOG.4 88.55,9.48 82.46,9.48 80.93,7.96 28.81,7.96 25.76,11 CN2.4
  Top 0.203: U3.A3 44.28,13.67 28.41,13.67 25.23,10.5 CN2.4
A4
  Top 0.203: U3.A4 46.19,13.04 30.95,13.04 28.41,10.5 CN3.1
  Bottom 0.152: ANALOG.5 90.99,10.85 83.83,10.85 80.63,7.65 31.1,7.65 28.36,10.39 CN3.1
A5
  Top 0.152: 44.36,12.4 44.36,9.94 46.03,8.26 80.78,8.26 84.59,12.07 88.55,12.07 ANALOG.6
  Top 0.203: U3.A5 48.09,12.4 44.36,12.4 34.12,12.4 32.22,10.5 CN3.2
A6
  Bottom 0.152: 36.09,11.19 39.33,7.96 80.48,7.96 85.96,13.44 90.99,13.44 ANALOG.7
  Bottom 0.203: U3.A6 51.9,13.67 38.57,13.67 36.09,11.19 35.39,10.5 CN3.3
A7
  Bottom 0.152: 39.75,11.04 42.53,8.26 80.32,8.26 86.72,14.66 88.55,14.66 ANALOG.8
  Bottom 0.203: U3.A7 53.81,13.04 41.74,13.04 39.75,11.04 39.2,10.5 CN3.4
A8
  Bottom 0.152: ANALOG1.1 90.08,21.22 89.47,21.22 78.5,10.24 78.5,9.94 77.12,8.57 46.64,8.57 46.34,8.87 44.81,8.87 42.83,10.85 CN4.1
  Bottom 0.203: U3.A8 58.25,15.58 55.08,12.4 44.28,12.4 42.38,10.5 CN4.1
A9
  Top 0.203: U3.A9 62.7,14.31 50.63,14.31 46.82,10.5 CN4.2
  Bottom 0.152: ANALOG1.2 87.64,22.43 87.64,21.82 78.04,12.22 76.36,12.22 76.06,11.92 69.66,11.92 68.13,10.39 68.13,9.94 67.37,9.18 46.95,9.18 45.73,10.39 CN4.2
A10
  Top 0.203: U3.A10 64.6,13.67 52.54,13.67 49.36,10.5 CN4.3
  Bottom 0.152: ANALOG1.3 90.08,23.65 90.08,23.35 88.86,22.13 88.86,21.98 78.8,11.92 76.67,11.92 74.99,10.24 74.99,9.94 73.92,8.87 46.8,8.87 46.49,9.18 45.12,9.18 44.36,9.94 44.36,11.16 45.12,11.92 47.71,11.92 49.08,10.55 CN4.3
A11
  Top 0.152: 58.23,13.04 58.23,9.94 59.29,8.87 77.89,8.87 78.8,9.79 78.8,10.55 86.27,18.01 86.27,22.89 87.64,24.26 87.64,25.03 ANALOG1.4
  Top 0.203: U3.A11 66.51,13.04 58.23,13.04 55.71,13.04 53.17,10.5 CN4.4
A12
  Top 0.152: ANALOG1.5 90.08,26.24 90.08,25.48 88.86,24.26 88.86,16.8 80.78,8.72 78.19,8.72 78.04,8.57 58.07,8.57 56.24,10.39 CN5.1
  Bottom 0.203: U3.A12 69.68,13.67 59.52,13.67 56.35,10.5 CN5.1
A13
  Top 0.152: 68.74,12.4 68.74,9.94 69.5,9.18 77.73,9.18 78.5,9.94 78.5,10.7 85.96,18.17 85.96,25.18 87.64,26.85 87.64,27.46 ANALOG1.6
  Top 0.203: U3.A13 70.95,12.4 68.74,12.4 62.06,12.4 60.16,10.5 CN5.2
A14
  Bottom 0.152: U3.A14 76.67,17.25 81.24,21.82 82.15,21.82 82.91,22.59 82.91,23.5 83.83,24.42 84.74,24.42 85.51,25.18 85.51,29.75 87.18,31.43 88.1,31.43 90.08,29.44 90.08,28.99 ANALOG1.7
  Bottom 0.203: U3.A14 74.13,13.04 65.87,13.04 63.33,10.5 CN5.3
A15
  Bottom 0.152: U3.A15 80.93,15.58 85.81,20.45 85.81,27.46 87.64,29.29 87.64,30.05 ANALOG1.8
  Bottom 0.203: U3.A15 76.03,12.4 69.05,12.4 67.14,10.5 CN5.4
CANH
  Bottom 0.203: U2.7 6.18,17.48 5.55,18.12 CN1.3
CANL
  Bottom 0.203: U2.6 6.18,16.21 5.55,15.58 CN1.2
GND
  Top 0.152: CN13.3 91.27,3.51 91.21,3.23
  Top 0.203: 6.82,56.22 6.82,62.57 8.72,64.47 S_CBUS.2 8.72,65.11 2.37,65.11 S_CBUS.1 | 6.82,56.22 LGREEN.K 3.64,46.69 3.64,7.96 | 6.82,56.22 LYELLOW.K | 5.55,7.96 9.99,7.96 RESET.2 | 5.55,7.96 3.64,7.96 | 5.55,7.96 CN1.1 | 3.64,7.96 RESET.1
  Bottom 0.152: C2.1 15.1,31.27 14.99,31.27
  Bottom 0.203: BUS_GND.1 22.06,40.98 LYELLOW.K | 3.01,33.36 U$1.9 | 4.91,25.74 C3.1
  Bottom 0.305: 3.01,33.36 3.01,28.66 2,26.36 2.04,24.53 4.55,24.45 C3.1
  pour Top: 0.47,0.29 0.47,0.34 0.51,0.34
  pour Top (isolate 0.305): 0.47,80.36 100.59,80.36 100.59,80.23 100.49,0.31 0.42,0.49
  pour Bottom (isolate 0.305): 99.95,79.96 100.57,0.44 0.47,0.03 0.47,80.12
MCP_CS  (via drill 0.51)
  Top 0.203: v22.06,32.72 80.48,32.72 81.11,32.09 84.92,32.09 85.56,31.45 85.56,30.18 84.92,29.55 83.65,29.55 83.02,28.91 83.02,24.47 U3.53
  Bottom 0.203: v22.06,32.72 10.62,44.01 U$1.16
MCP_SCK
  Bottom 0.203: U$1.13 6.82,43.2 13.8,36.21 13.8,28.59 17.61,24.78 80.16,24.78 U3.52
MCP_SI
  Bottom 0.203: U$1.14 8.09,45.42 8.72,46.06 9.99,46.06 9.99,43.2 23.33,29.86 78.25,29.86 81.11,27.01 83.02,27.01 U3.51
MCP_SO
  Bottom 0.203: U$1.15 9.36,41.61 22.06,28.91 22.06,27.96 22.69,27.32 80.16,27.32 U3.50
N$1
  Bottom 0.203: 7.45,25.74 C4.2
  Bottom 0.305: 7.45,25.74 7.45,27.04 Q1.2 | C4.2 7.18,32.38 5.68,32.99 U$1.7
N$2
  Bottom 0.305: C3.2 3.38,27.79 Q1.1 U$1.8
N$3
  Bottom 0.203: LYELLOW.A 9.99,50.5 9.99,56.22 R2.2
N$4
  Bottom 0.203: LGREEN.A 6.18,51.77 6.18,53.68 R1.2
N$9
  Top 0.203: RESET.3 3.64,3.51 9.99,3.51 RESET.4
  Bottom 0.203: U3.RESET 15.71,10.5 15.71,8.59 10.63,3.51 RESET.4
N$31
  Top 0.406: 23.37,37.18 71.61,37.18
N$51
  Bottom 0.203: 83.02,37.8 83.02,37.66
N$52
  Top 0.305: 23.24,40.97 23.24,40.88
  Top 0.406: 71.61,40.97 23.24,40.97
N$54
  Bottom 0.203: U$1.17 11.9,43.52 12.21,43.2 16.02,43.2 R4.1
RXCAN  (via drill 0.51)
  Top 0.203: v11.9,14.31 v11.9,20.66
  Bottom 0.203: v11.9,20.66 U$1.2 | v11.9,14.31 13.8,14.31 14.44,14.94 U2.4
TXCAN
  Bottom 0.203: U$1.1 13.17,20.02 14.44,18.75 U2.1
VCC
  Top 0.152: CN13.4 94.65,3.08 93.43,1.86 87.18,1.86 85.96,3.08 84.29,3.08 CN13.1 84.13,3.23 83.52,3.23 81.24,5.52 17.23,5.52 6.87,15.88 6.87,20.76 5.65,21.98 CN1.4
  Bottom 0.152: 7.48,45.9 7.48,46.06 8.7,47.28 8.72,47.33 | 7.48,45.9 7.48,43.01 15.4,35.08 15.4,34.78 15.1,34.47 15.1,33.25 C2.2 | R4.2 16.16,41.64 17.23,42.7 17.23,44.23 16.93,44.53 13.27,44.53 U$1.18 | U3.5V@1 81.85,63.89 81.85,64.95 82.15,65.26 82.15,65.56 81.7,66.02 80.02,66.02 72.55,58.55 7.63,58.55 6.56,57.49 R3.1 | U3.5V@0 25.76,15.58 24.55,16.8 20.28,16.8 19.67,16.19 17.69,16.19 C1.1 17.54,16.19 16.93,16.8 13.42,16.8 8.24,21.98 6.26,21.98 | 6.26,21.98 5.65,21.98 CN1.4 6.26,21.98 | 7.48,45.9 6.41,45.9 6.11,45.6 6.11,37.06 4.89,35.85 4.89,33.71 5.19,33.41 5.19,32.34 6.26,31.27 6.26,21.98
  Bottom 0.203: U$1.18 13.17,45.74 11.58,47.33 8.72,47.33 8.72,53.36 7.13,54.95 6.5,54.95 R3.1

### Text on the board
tPlace: 7 | 3 | 0 | 12 | 11 | 10 | 9 | 8 | 6 | 5 | 4 | 2 | 1 | 14 | 15 | 16 | 17 | 18 | 19 | 20 | S-CBUS | G | Y | GND | VCC | + | H | L | - | A0 | A1 | A2 | A3 | A4 | A5 | A6 | A7 | A8 | A9 | A10 | A11 | A12 | A13 | A14 | A15 | 47 | 48 | 49 | RESET | vcc | GND | vcc
bPlace: 12 | 11 | 10 | 9 | 8 | 7 | 6 | 5 | 4 | 3 | 2 | 1 | 0 | 14 | 15 | 16 | 17 | 18 | 19 | 20 | R3 | R2 | R1 | C1 | GND | VCC | C2 | C3 | C4 | A0 | A1 | A2 | A3 | A4 | A5 | A6 | A7 | A8 | A9 | A10 | A11 | A12 | A13 | A14 | A15 | 47 | 48 | 49